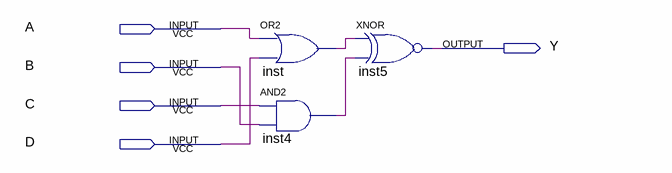
[diagram p0: schematic sheet]
// Quartus schematic Pract_1.bdf as structural Verilog: 3 symbols, 5 pins
module Pract_1 (
  input  A,
  input  B,
  input  C,
  input  D,
  output Y
);

  wire inst4_out, inst_out;

  or inst (inst_out, A, D);
  and inst4 (inst4_out, C, B);
  xnor inst5 (Y, inst_out, inst4_out);
endmodule
